# EAGLE schematic SensorStick (EAGLE 9.6.2)

## Sheet 1 of 2
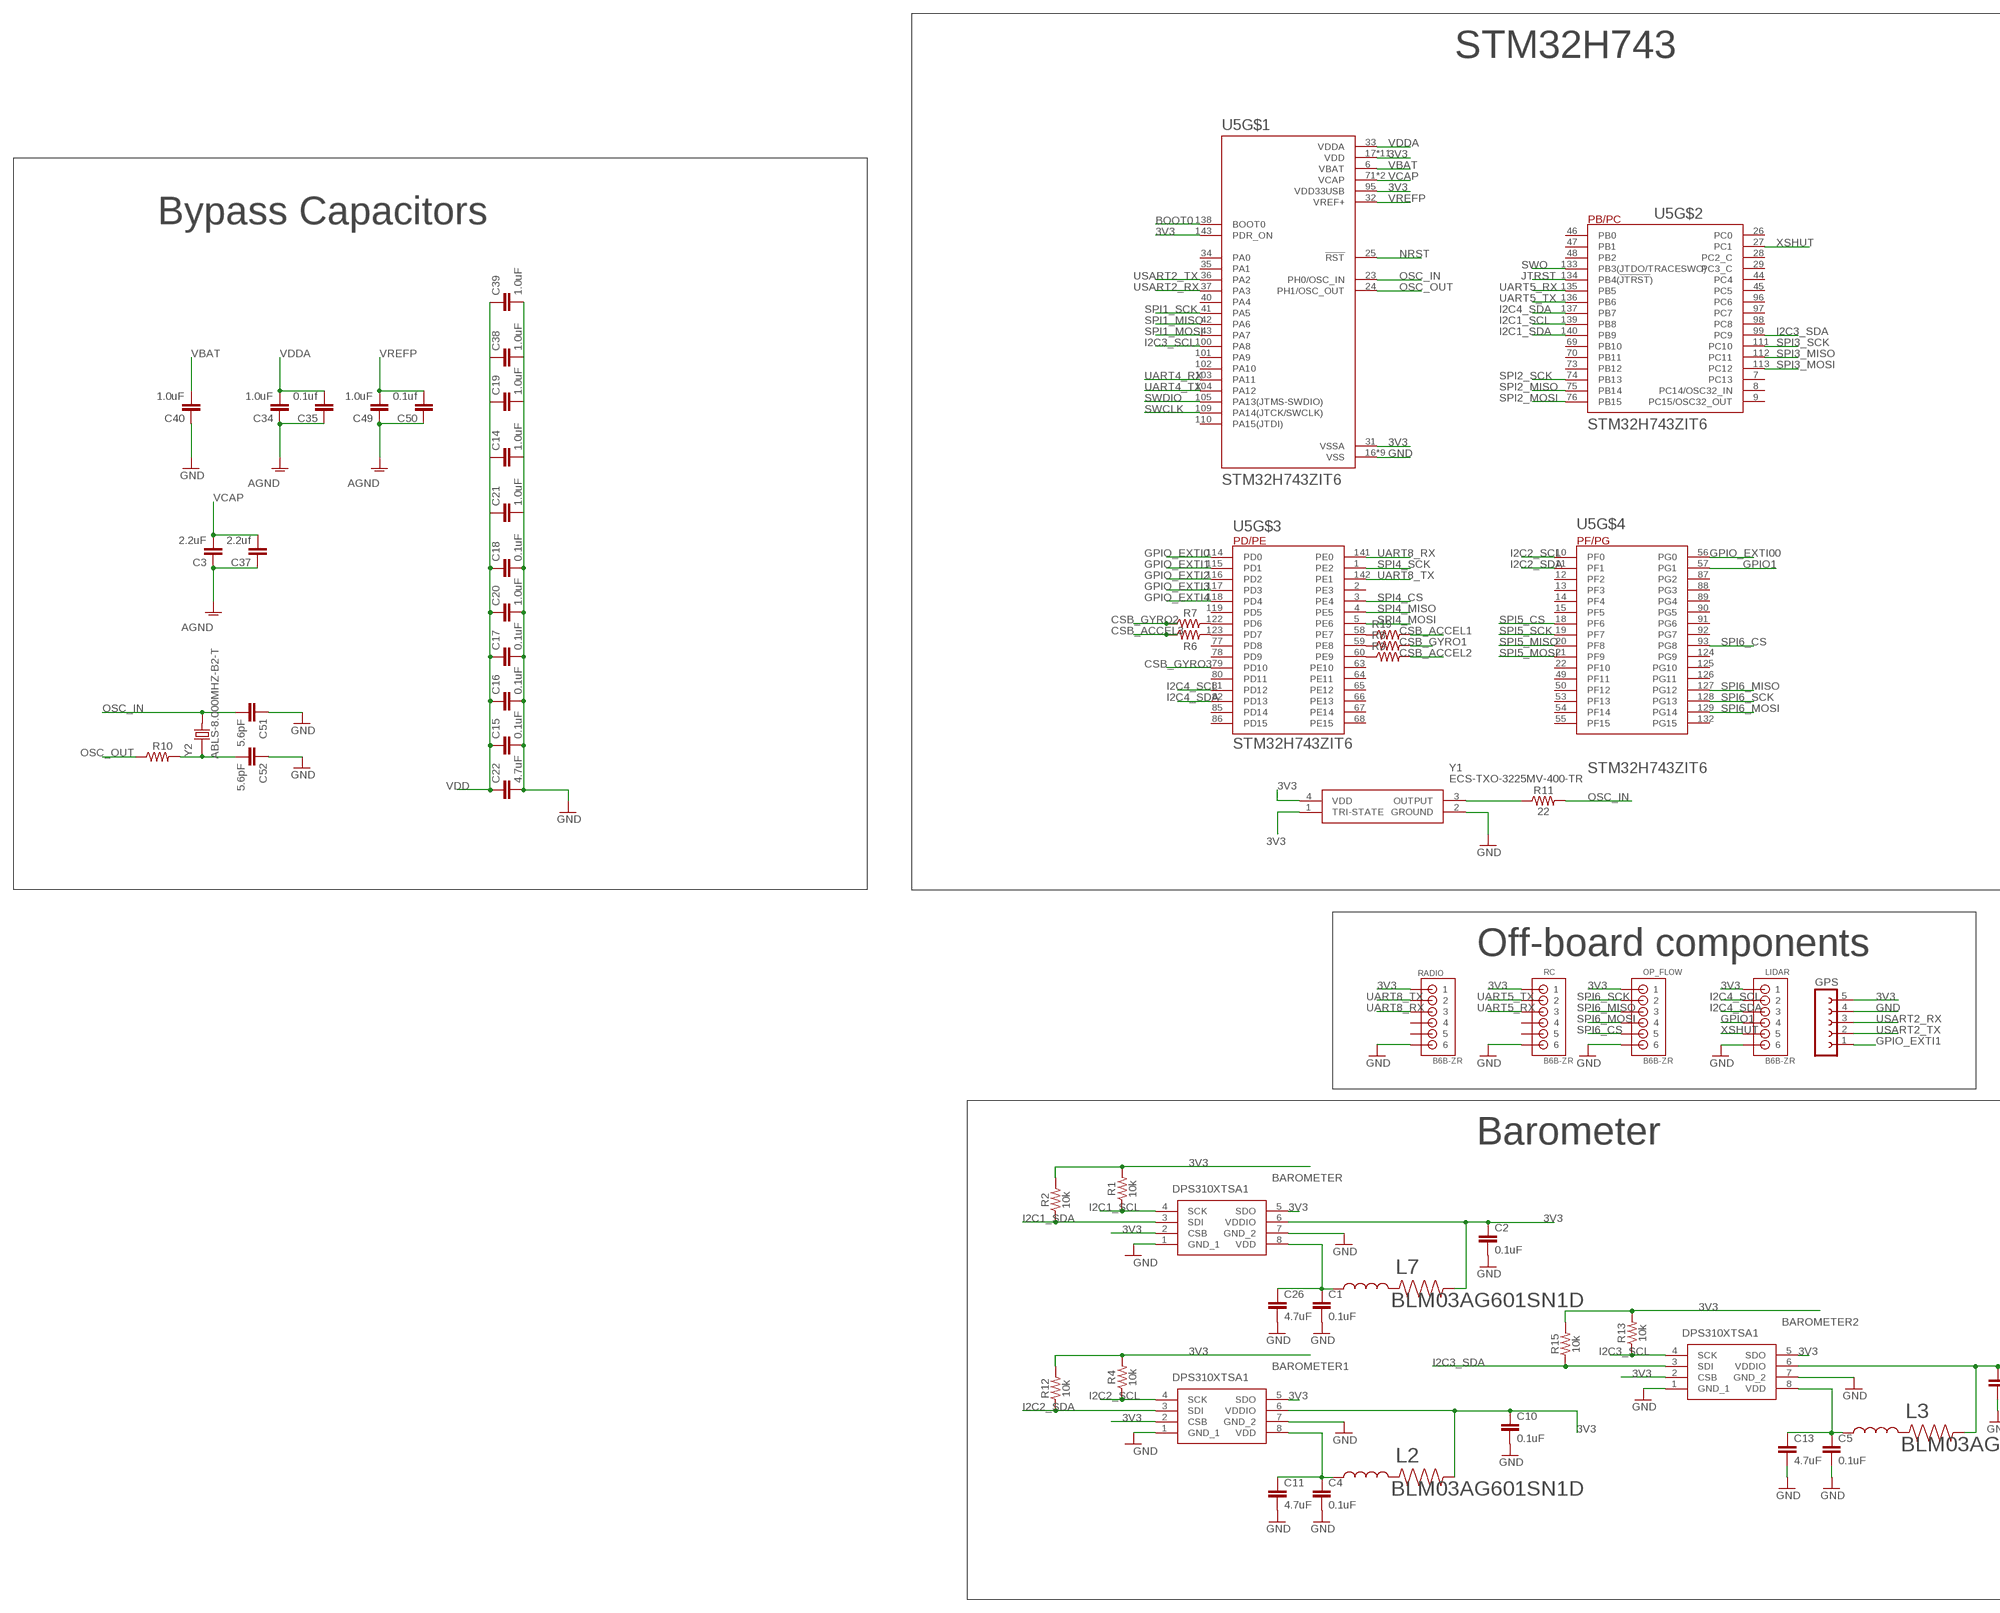
[diagram p0: schematic, sheet 1, part 1 of 2]
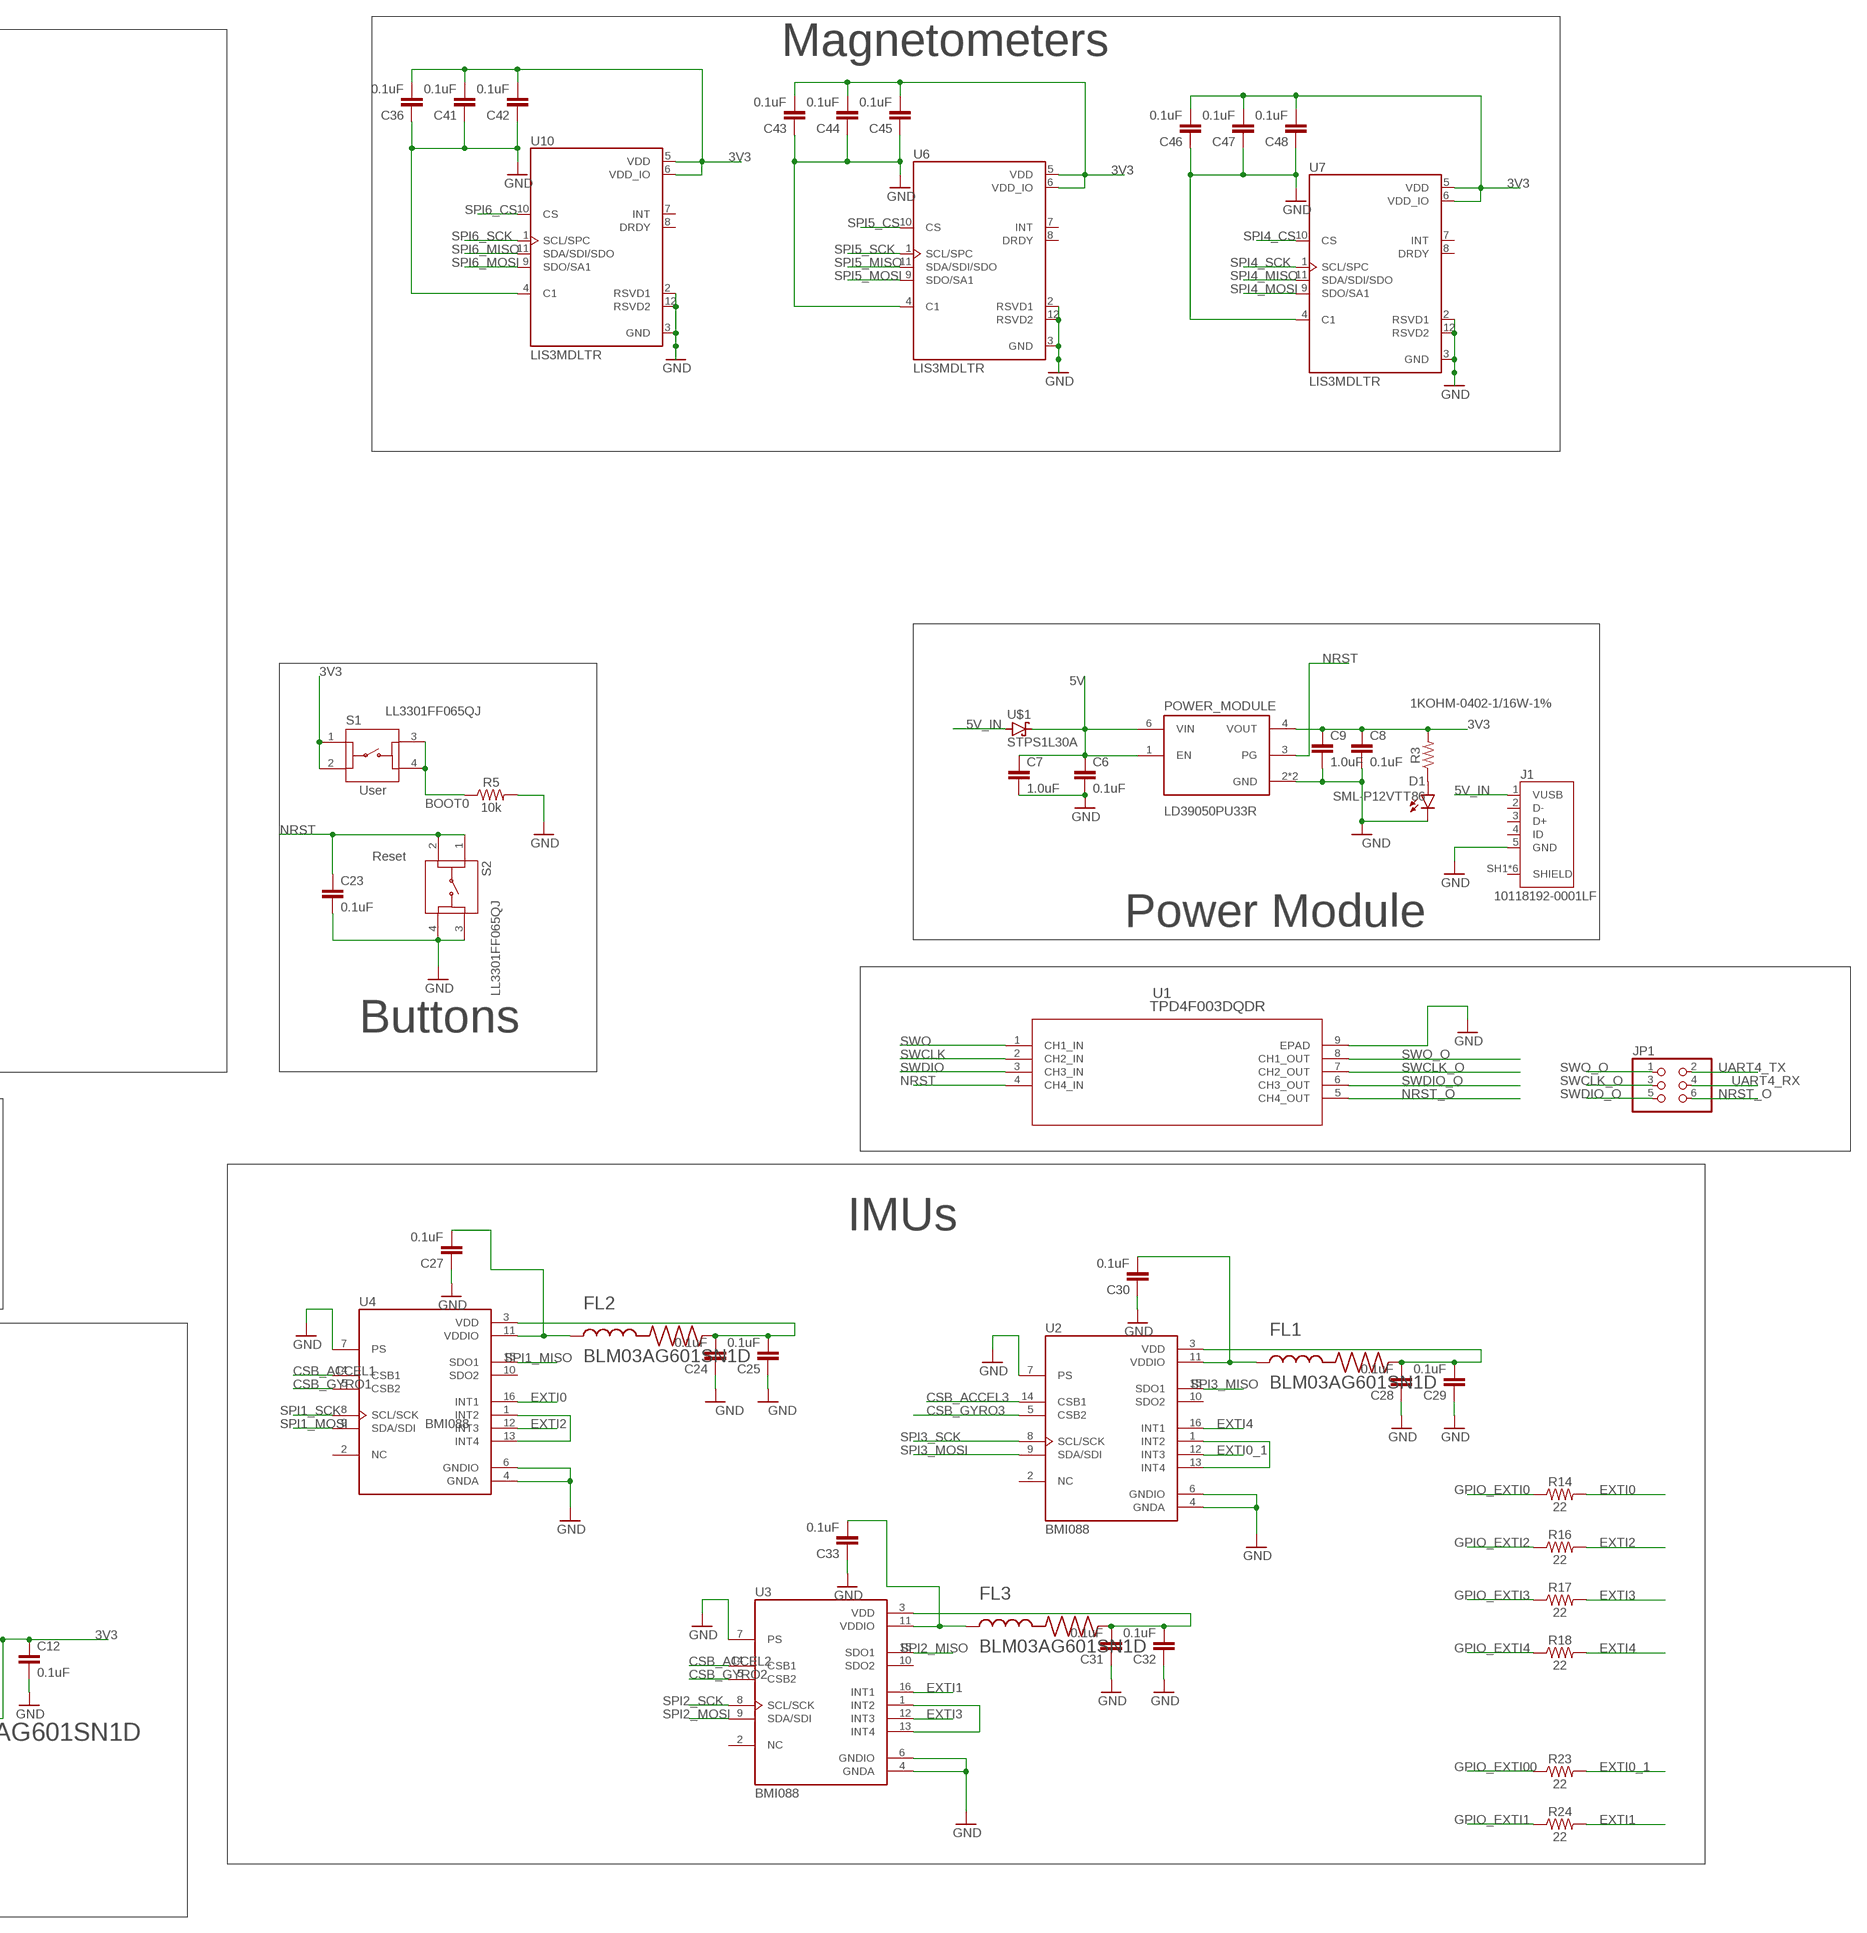
[diagram p1: schematic, sheet 1, part 2 of 2]

### Parts
BAROMETER  DPS310XTSA1  [DPS310XTSA1]
BAROMETER1  DPS310XTSA1  [DPS310XTSA1]
BAROMETER2  DPS310XTSA1  [DPS310XTSA1]
C1  0.1uF  0.1UF-0402-6.3V-10%-X7R  [0402]
C2  0.1uF  0.1UF-0402-6.3V-10%-X7R  [0402]
C3  2.2uF  1.0UF-0805-25V-10%  [0805]
C4  0.1uF  0.1UF-0402-6.3V-10%-X7R  [0402]
C5  0.1uF  0.1UF-0402-6.3V-10%-X7R  [0402]
C6  0.1uF  0.1UF-0402-6.3V-10%-X7R  [0402]
C7  1.0uF  1.0UF-0402-16V-10%  [0402]
C8  0.1uF  0.1UF-0402-6.3V-10%-X7R  [0402]
C9  1.0uF  1.0UF-0402-16V-10%  [0402]
C10  0.1uF  0.1UF-0402-6.3V-10%-X7R  [0402]
C11  4.7uF  4.7UF0603  [0603]
C12  0.1uF  0.1UF-0402-6.3V-10%-X7R  [0402]
C13  4.7uF  4.7UF0603  [0603]
C14  1.0uF  1.0UF-0805-25V-10%  [0805]
C15  0.1uF  0.1UF-0603-25V-5%  [0603]
C16  0.1uF  0.1UF-0603-25V-5%  [0603]
C17  0.1uF  0.1UF-0603-25V-5%  [0603]
C18  0.1uF  0.1UF-0603-25V-5%  [0603]
C19  1.0uF  1.0UF-0805-25V-10%  [0805]
C20  1.0uF  1.0UF-0805-25V-10%  [0805]
C21  1.0uF  1.0UF-0805-25V-10%  [0805]
C22  4.7uF  4.7UF0603  [0603]
C23  0.1uF  0.1UF-0603-25V-5%  [0603]
C24  0.1uF  0.1UF-0603-25V-5%  [0603]
C25  0.1uF  0.1UF-0603-25V-5%  [0603]
C26  4.7uF  4.7UF0603  [0603]
C27  0.1uF  0.1UF-0603-25V-5%  [0603]
C28  0.1uF  0.1UF-0603-25V-5%  [0603]
C29  0.1uF  0.1UF-0603-25V-5%  [0603]
C30  0.1uF  0.1UF-0603-25V-5%  [0603]
C31  0.1uF  0.1UF-0603-25V-5%  [0603]
C32  0.1uF  0.1UF-0603-25V-5%  [0603]
C33  0.1uF  0.1UF-0603-25V-5%  [0603]
C34  1.0uF  1.0UF-0805-25V-10%  [0805]
C35  0.1uf  1.0UF-0805-25V-10%  [0805]
C36  0.1uF  0.1UF-0603-25V-5%  [0603]
C37  2.2uf  1.0UF-0805-25V-10%  [0805]
C38  1.0uF  1.0UF-0805-25V-10%  [0805]
C39  1.0uF  1.0UF-0805-25V-10%  [0805]
C40  1.0uF  1.0UF-0805-25V-10%  [0805]
C41  0.1uF  0.1UF-0603-25V-5%  [0603]
C42  0.1uF  0.1UF-0603-25V-5%  [0603]
C43  0.1uF  0.1UF-0603-25V-5%  [0603]
C44  0.1uF  0.1UF-0603-25V-5%  [0603]
C45  0.1uF  0.1UF-0603-25V-5%  [0603]
C46  0.1uF  0.1UF-0603-25V-5%  [0603]
C47  0.1uF  0.1UF-0603-25V-5%  [0603]
C48  0.1uF  0.1UF-0603-25V-5%  [0603]
C49  1.0uF  1.0UF-0805-25V-10%  [0805]
C50  0.1uf  1.0UF-0805-25V-10%  [0805]
C51  5.6pF  1.0UF-0805-25V-10%  [0805]
C52  5.6pF  1.0UF-0805-25V-10%  [0805]
D1  SML-P12VTT86  [LED_SML-P11UTT86R]
FL1  BLM03AG601SN1D  [BEADC0603X33N]
FL2  BLM03AG601SN1D  [BEADC0603X33N]
FL3  BLM03AG601SN1D  [BEADC0603X33N]
GPS  FE05-1  [FE05-1]
J1  10118192-0001LF  [AMPHENOL_10118192-0001LF]
JP1  PINHD-2X3  [2X03]
L2  BLM03AG601SN1D  [BEADC0603X33N]
L3  BLM03AG601SN1D  [BEADC0603X33N]
L7  BLM03AG601SN1D  [BEADC0603X33N]
LIDAR  B6B-ZR  [B6B-ZR]
OP_FLOW  B6B-ZR  [B6B-ZR]
POWER_MODULE  LD39050PU33R  [SON95P300X300X100-7N]
R1  10k  10KOHM-0402-1/16W-1%  [0402]
R2  10k  10KOHM-0402-1/16W-1%  [0402]
R3  1KOHM-0402-1/16W-1%  [0402]
R4  10k  10KOHM-0402-1/16W-1%  [0402]
R5  10k  10KOHM-0603-1/10W-1%  [0603]
R6  RT0402FRE07220RL  [RESC1005X35N]
R7  RT0402FRE07220RL  [RESC1005X35N]
R8  RT0402FRE07220RL  [RESC1005X35N]
R9  RT0402FRE07220RL  [RESC1005X35N]
R10  220  RT0402FRE07220RL  [RESC1005X35N]
R11  22  22OHM-0402-1/10W-1%  [0402]
R12  10k  10KOHM-0402-1/16W-1%  [0402]
R13  10k  10KOHM-0402-1/16W-1%  [0402]
R14  22  22OHM-0402-1/10W-1%  [0402]
R15  10k  10KOHM-0402-1/16W-1%  [0402]
R16  22  22OHM-0402-1/10W-1%  [0402]
R17  22  22OHM-0402-1/10W-1%  [0402]
R18  22  22OHM-0402-1/10W-1%  [0402]
R19  RT0402FRE07220RL  [RESC1005X35N]
R23  22  22OHM-0402-1/10W-1%  [0402]
R24  22  22OHM-0402-1/10W-1%  [0402]
RADIO  B6B-ZR  [B6B-ZR]
RC  B6B-ZR  [B6B-ZR]
S1  LL3301FF065QJ  [LL3301FF065QJ]
S2  LL3301FF065QJ  [LL3301FF065QJ]
U1  TPD4F003DQDR  [DQD8_1P2X0P4]
U2  BMI088  [PQFN50P450X300X100-16N]
U3  BMI088  [PQFN50P450X300X100-16N]
U4  BMI088  [PQFN50P450X300X100-16N]
U5  STM32H743ZIT6  [QFP50P2200X2200X160-144N]
U6  LIS3MDLTR  [XDCR_LIS3MDLTR]
U7  LIS3MDLTR  [XDCR_LIS3MDLTR]
U10  LIS3MDLTR  [XDCR_LIS3MDLTR]
U$1  STPS1L30A  [DIOM5226X223N]
Y1  ECS-TXO-3225MV-400-TR  [ECSTXO3225MV400TR]
Y2  ABLS-8.000MHZ-B2-T  [XTAL_ABLS-8.000MHZ-B2-T]

### Nets
3V2: C28.2 C29.2 FL1.2 U2.3(VDD)
3V3: BAROMETER1.2(CSB) BAROMETER1.5(SDO) BAROMETER1.6(VDDIO) BAROMETER2.2(CSB) BAROMETER2.5(SDO) BAROMETER2.6(VDDIO) BAROMETER.2(CSB) BAROMETER.5(SDO) BAROMETER.6(VDDIO) C2.1 C8.1 C9.1 C10.1 C12.1 C36.2 C41.2 C42.2 C43.2 C44.2 C45.2 C46.2 C47.2 C48.2 GPS.5 L2.2 L3.2 L7.2 LIDAR.1 OP_FLOW.1 POWER_MODULE.4(VOUT) R1.2 R2.2 R3.2 R4.2 R12.2 R13.2 R15.2 RADIO.1 RC.1 S1.1 S1.2 U5.17(VDD) U5.30(VDD) U5.31(VSSA) U5.39(VDD) U5.52(VDD) U5.62(VDD) U5.72(VDD) U5.84(VDD) U5.95(VDD33USB) U5.108(VDD) U5.121(VDD) U5.131(VDD) U5.143(PDR_ON) U5.144(VDD) U6.5(VDD) U6.6(VDD_IO) U7.5(VDD) U7.6(VDD_IO) U10.5(VDD) U10.6(VDD_IO) Y1.1(TRI-STATE) Y1.4(VDD)
3V4: C24.2 C25.2 FL2.2 U4.3(VDD)
3V5: C31.2 C32.2 FL3.2 U3.3(VDD)
5V: C6.1 C7.1 POWER_MODULE.1(EN) POWER_MODULE.6(VIN) U$1.1(C)
5V_IN: J1.1(VUSB) U$1.2(A)
AGND: C3.1 C34.1 C35.1 C37.1 C49.1 C50.1
BOOT0: R5.1 S1.3 S1.4 U5.138(BOOT0)
CSB_ACCEL1: R19.2 U4.14(CSB1)
CSB_ACCEL2: R9.2 U3.14(CSB1)
CSB_ACCEL3: R6.1 U2.14(CSB1)
CSB_GYRO1: R8.2 U4.5(CSB2)
CSB_GYRO2: R7.1 U3.5(CSB2)
CSB_GYRO3: U2.5(CSB2) U5.79(PD10)
EXTI0: R14.2 U4.16(INT1)
EXTI0_1: R23.2 U2.12(INT3)
EXTI1: R24.2 U3.16(INT1)
EXTI2: R16.2 U4.12(INT3)
EXTI3: R17.2 U3.12(INT3)
EXTI4: R18.2 U2.16(INT1)
GND: BAROMETER1.1(GND_1) BAROMETER1.7(GND_2) BAROMETER2.1(GND_1) BAROMETER2.7(GND_2) BAROMETER.1(GND_1) BAROMETER.7(GND_2) C1.2 C2.2 C4.2 C5.2 C6.2 C7.2 C8.2 C9.2 C10.2 C11.2 C12.2 C13.2 C23.2 C24.1 C25.1 C26.2 C27.1 C28.1 C29.1 C30.1 C31.1 C32.1 C33.1 C36.1 C40.1 C41.1 C42.1 C43.1 C44.1 C45.1 C46.1 C47.1 C48.1 C51.1 C52.1 D1.C GPS.4 J1.5(GND) LIDAR.6 OP_FLOW.6 POWER_MODULE.2(GND) POWER_MODULE.7(GND) R5.2 S2.3 S2.4 U1.9(EPAD) U2.4(GNDA) U2.6(GNDIO) U2.7(PS) U3.4(GNDA) U3.6(GNDIO) U3.7(PS) U4.4(GNDA) U4.6(GNDIO) U4.7(PS) U5.16(VSS) U5.38(VSS) U5.51(VSS) U5.61(VSS) U5.83(VSS) U5.94(VSS) U5.107(VSS) U5.120(VSS) U5.130(VSS) U6.2(RSVD1) U6.3(GND) U6.4(C1) U6.12(RSVD2) U7.2(RSVD1) U7.3(GND) U7.4(C1) U7.12(RSVD2) U10.2(RSVD1) U10.3(GND) U10.4(C1) U10.12(RSVD2) Y1.2(GROUND)
GND1: C14.2 C15.2 C16.2 C17.2 C18.2 C20.2 C21.2 C22.2 ; supply symbol labelled GND
GND2: C19.2
GND3: C38.2
GND4: C39.2
GPIO1: LIDAR.4 U5.57(PG1)
GPIO_EXTI0: R14.1 U5.114(PD0)
GPIO_EXTI00: R23.1 U5.56(PG0)
GPIO_EXTI1: GPS.1 R24.1 U5.115(PD1)
GPIO_EXTI2: R16.1 U5.116(PD2)
GPIO_EXTI3: R17.1 U5.117(PD3)
GPIO_EXTI4: R18.1 U5.118(PD4)
I2C1_SCL: BAROMETER.4(SCK) R1.1 U5.139(PB8)
I2C1_SDA: BAROMETER.3(SDI) R2.1 U5.140(PB9)
I2C2_SCL: BAROMETER1.4(SCK) R4.1 U5.10(PF0)
I2C2_SDA: BAROMETER1.3(SDI) R12.1 U5.11(PF1)
I2C3_SCL: BAROMETER2.4(SCK) R13.1 U5.100(PA8)
I2C3_SDA: BAROMETER2.3(SDI) R15.1 U5.99(PC9)
I2C4_SCL: LIDAR.2 U5.81(PD12)
I2C4_SDA: LIDAR.3 U5.82(PD13) U5.137(PB7)
IMU_INT3: U3.1(INT2) U3.13(INT4)
JTRST: U5.134(PB4(!JTRST!))
N$1: R11.1 Y1.3(OUTPUT)
N$2: BAROMETER2.8(VDD) C5.1 C13.1 L3.1
N$3: BAROMETER1.8(VDD) C4.1 C11.1 L2.1
N$5: D1.A R3.1
N$6: BAROMETER.8(VDD) C1.1 C26.1 L7.1
N$7: C52.2 R10.2 Y2.1
N$8: C27.2 FL2.1 U4.11(VDDIO)
N$9: C30.2 FL1.1 U2.11(VDDIO)
N$10: C33.2 FL3.1 U3.11(VDDIO)
N$13: R6.2 U5.123(PD7)
N$14: R7.2 U5.122(PD6)
N$15: R19.1 U5.58(PE7)
N$16: R8.1 U5.59(PE8)
N$17: R9.1 U5.60(PE9)
N$19: RADIO.6 RC.6 ; supply symbol labelled GND
N$20: U4.1(INT2) U4.13(INT4)
N$23: U2.1(INT2) U2.13(INT4)
NRST: C23.1 POWER_MODULE.3(PG) S2.1 S2.2 U1.4(CH4_IN) U5.25(!RST)
NRST_O: JP1.6 U1.5(CH4_OUT)
OSC_IN: C51.2 R11.2 U5.23(PH0/OSC_IN) Y2.2
OSC_OUT: R10.1 U5.24(PH1/OSC_OUT)
SPI1_MISO: U4.15(SDO1) U5.42(PA6)
SPI1_MOSI: U4.9(SDA/SDI) U5.43(PA7)
SPI1_SCK: U4.8(SCL/SCK) U5.41(PA5)
SPI2_MISO: U3.15(SDO1) U5.75(PB14)
SPI2_MOSI: U3.9(SDA/SDI) U5.76(PB15)
SPI2_SCK: U3.8(SCL/SCK) U5.74(PB13)
SPI3_MISO: U2.15(SDO1) U5.112(PC11)
SPI3_MOSI: U2.9(SDA/SDI) U5.113(PC12)
SPI3_SCK: U2.8(SCL/SCK) U5.111(PC10)
SPI4_CS: U5.3(PE4) U7.10(CS)
SPI4_MISO: U5.4(PE5) U7.11(SDA/SDI/SDO)
SPI4_MOSI: U5.5(PE6) U7.9(SDO/SA1)
SPI4_SCK: U5.1(PE2) U7.1(SCL/SPC)
SPI5_CS: U5.18(PF6) U6.10(CS)
SPI5_MISO: U5.20(PF8) U6.11(SDA/SDI/SDO)
SPI5_MOSI: U5.21(PF9) U6.9(SDO/SA1)
SPI5_SCK: U5.19(PF7) U6.1(SCL/SPC)
SPI6_CS: OP_FLOW.5 U5.93(PG8) U10.10(CS)
SPI6_MISO: OP_FLOW.3 U5.127(PG12) U10.11(SDA/SDI/SDO)
SPI6_MOSI: OP_FLOW.4 U5.129(PG14) U10.9(SDO/SA1)
SPI6_SCK: OP_FLOW.2 U5.128(PG13) U10.1(SCL/SPC)
SWCLK: U1.2(CH2_IN) U5.109(PA14(JTCK/SWCLK))
SWCLK_O: JP1.3 U1.7(CH2_OUT)
SWDIO: U1.3(CH3_IN) U5.105(PA13(JTMS-SWDIO))
SWDIO_O: JP1.5 U1.6(CH3_OUT)
SWO: U1.1(CH1_IN) U5.133(PB3(JTDO/TRACESWO))
SWO_O: JP1.1 U1.8(CH1_OUT)
UART4_RX: JP1.4 U5.103(PA11)
UART4_TX: JP1.2 U5.104(PA12)
UART5_RX: RC.3 U5.135(PB5)
UART5_TX: RC.2 U5.136(PB6)
UART8_RX: RADIO.3 U5.141(PE0)
UART8_TX: RADIO.2 U5.142(PE1)
USART2_RX: GPS.3 U5.37(PA3)
USART2_TX: GPS.2 U5.36(PA2)
VBAT: C40.2 U5.6(VBAT)
VCAP: C3.2 C37.2 U5.71(VCAP) U5.106(VCAP)
VDD: C15.1 C16.1 C17.1 C18.1 C20.1 C21.1 C22.1
VDDA: C34.2 C35.2 U5.33(VDDA)
VREF1: C14.1
VREF2: C19.1
VREF3: C38.1
VREF4: C39.1
VREFP: C49.2 C50.2 U5.32(VREF+)
XSHUT: LIDAR.5 U5.27(PC1)
Unconnected: J1.2(D-) J1.3(D+) J1.4(ID) J1.SH1(SHIELD) J1.SH2(SHIELD) J1.SH3(SHIELD) J1.SH4(SHIELD) J1.SH5(SHIELD) J1.SH6(SHIELD) RADIO.4 RADIO.5 RC.4 RC.5 U2.2(NC) U2.10(SDO2) U3.2(NC) U3.10(SDO2) U4.2(NC) U4.10(SDO2) U5.2(PE3) U5.7(PC13) U5.8(PC14/OSC32_IN) U5.9(PC15/OSC32_OUT) U5.12(PF2) U5.13(PF3) U5.14(PF4) U5.15(PF5) U5.22(PF10) U5.26(PC0) U5.28(PC2_C) U5.29(PC3_C) U5.34(PA0) U5.35(PA1) U5.40(PA4) U5.44(PC4) U5.45(PC5) U5.46(PB0) U5.47(PB1) U5.48(PB2) U5.49(PF11) U5.50(PF12) U5.53(PF13) U5.54(PF14) U5.55(PF15) U5.63(PE10) U5.64(PE11) U5.65(PE12) U5.66(PE13) U5.67(PE14) U5.68(PE15) U5.69(PB10) U5.70(PB11) U5.73(PB12) U5.77(PD8) U5.78(PD9) U5.80(PD11) U5.85(PD14) U5.86(PD15) U5.87(PG2) U5.88(PG3) U5.89(PG4) U5.90(PG5) U5.91(PG6) U5.92(PG7) U5.96(PC6) U5.97(PC7) U5.98(PC8) U5.101(PA9) U5.102(PA10) U5.110(PA15(JTDI)) U5.119(PD5) U5.124(PG9) U5.125(PG10) U5.126(PG11) U5.132(PG15) U6.7(INT) U6.8(DRDY) U7.7(INT) U7.8(DRDY) U10.7(INT) U10.8(DRDY)

### Notes on the sheet
- Magnetometers
- STM32H743
- Bypass Capacitors
- User
- Reset
- Power Module
- Buttons
- Off-board components
- IMUs
- Barometer

## Sheet 2 of 2

## Library data of the parts
BAROMETER BAROMETER1 BAROMETER2 = DPS310XTSA1:DPS310XTSA1: INFINEON - DPS310XTSA1 - DIGITAL PRESSURE SENSOR, 1200HPA, VLGA-8 Source: Datasheet <https://www.infineon.com/dgdl/Infineon-DPS310-DS-v01_00-EN.pdf?fileId=5546d462576f34750157750826c42242>; ARROW_PART_NUMBER: DPS310XTSA1; ARROW_PRICE-STOCK: https://www.arrow.com/en/products/dps310xtsa1/infineon-technologies-ag?region=nac; DESCRIPTION: INFINEON - DPS310XTSA1 - DIGITAL PRESSURE SENSOR, 1200HPA, VLGA-8; HEIGHT: 1.01mm; MANUFACTURER_NAME: Infineon; MANUFACTURER_PART_NUMBER: DPS310XTSA1; MOUSER_PART_NUMBER: 726-DPS310XTSA1; MOUSER_PRICE-STOCK: https://www.mouser.co.uk/ProductDetail/Infineon-Technologies/DPS310XTSA1?qs=uuTTuBTXn66Ynca8WHwycg%3D%3D
C1 C2 C4-C6 C8 C10 C12 = SparkFun-Capacitors:0.1UF: 0.1µF ceramic capacitors A capacitor is a passive two-terminal electrical component used to store electrical energy temporarily in an electric field.; PROD_ID: CAP-14993
C3 C35 C37 C50-C52 = SparkFun-Capacitors:1.0UF: 1µF ceramic capacitors A capacitor is a passive two-terminal electrical component used to store electrical energy temporarily in an electric field.; PROD_ID: CAP-08064; VALUE: 1.0uF
C7 C9 = SparkFun-Capacitors:1.0UF: 1µF ceramic capacitors A capacitor is a passive two-terminal electrical component used to store electrical energy temporarily in an electric field.; PROD_ID: CAP-12417
C11 C13 C22 C26 = SparkFun-Capacitors:4.7UF: 4.7µF ceramic capacitors A capacitor is a passive two-terminal electrical component used to store electrical energy temporarily in an electric field.; PROD_ID: CAP-08280
C14 C19-C21 C34 C38-C40 C49 = SparkFun-Capacitors:1.0UF: 1µF ceramic capacitors A capacitor is a passive two-terminal electrical component used to store electrical energy temporarily in an electric field.; PROD_ID: CAP-08064
C15-C18 C23-C25 C27-C33 C36 C41-C48 = SparkFun-Capacitors:0.1UF: 0.1µF ceramic capacitors A capacitor is a passive two-terminal electrical component used to store electrical energy temporarily in an electric field.; PROD_ID: CAP-08604
D1 = ce-capstone:SML-P12VTT86: SML-P1 Series Red 0402 Clear 60 mcd 2 V Surface Mount PICOLED LED; AVAILABILITY: Unavailable; DESCRIPTION: Red 630nm LED Indication - Discrete 2V 0402 _1006 Metric_; MF: Rohm; MP: SML-P12VTT86; PACKAGE: 0402 Rohm; PRICE: None
FL1-FL3 L2 L3 L7 = BLM03AG601SN1D:BLM03AG601SN1D: Ferrite Bead 600R 100mA SMD 0201 Check availability <https://pricing.snapeda.com/parts/BLM03AG601SN1D/Murata%20Electronics/view-part?ref=eda>; AVAILABILITY: In Stock; CHECK_PRICES: https://www.snapeda.com/parts/BLM03AG601SN1D/Murata/view-part/?ref=eda; DESCRIPTION: 600 Ohms @ 100 MHz 1 - Ferrite Bead 0201 (0603 Metric) 100mA 1.5Ohm; MF: Murata Electronics; MP: BLM03AG601SN1D; PACKAGE: 0603 Murata; PRICE: None; PURCHASE-URL: https://www.snapeda.com/api/url_track_click_mouser/?unipart_id=283112&manufacturer=Murata Electronics&part_name=BLM03AG601SN1D&search_term=None; SNAPEDA_LINK: https://www.snapeda.com/parts/BLM03AG601SN1D/Murata/view-part/?ref=snap
GPS = con-lsta:FE05-1: FEMALE HEADER; OC_FARNELL: unknown; OC_NEWARK: unknown
J1 = ce-capstone:10118192-0001LF: Single Port 5 Contact Horizontal Right Angle Shielded Micro B USB 2.0 Connector; AVAILABILITY: Unavailable; DESCRIPTION: USB - micro B USB 2.0 Receptacle Connector 5 Position Surface Mount, Right Angle; MF: Amphenol ICC; MP: 10118192-0001LF; PACKAGE: None; PRICE: None
JP1 = pinhead:PINHD-2X3: PIN HEADER
LIDAR OP_FLOW RADIO RC = jst:B6B-ZR: JST-ZH Connector 6 pol, 1.5mm pitch Package: B6B-ZR Source: http://www.jst-mfg.com/product/pdf/eng/eZH.pdf
POWER_MODULE = ce-capstone:LD39050PU33R: LD39050 Series 500 mA 3.3 V Fixed Low Noise LDO Voltage Regulator - DFN-6; AVAILABILITY: Unavailable; DESCRIPTION: Linear Voltage Regulator IC 1 Output 500mA 6-DFN _3x3_; MF: STMicroelectronics; MP: LD39050PU33R; PACKAGE: DFN-6 STMicroelectronics; PRICE: None
R1 R2 R4 R12 R13 R15 = SparkFun-Resistors:10KOHM: 10kΩ resistor A resistor is a passive two-terminal electrical component that implements electrical resistance as a circuit element. Resistors act to reduce current flow, and, at the same time, act to lower voltage levels within circuits. - Wikipedia; PROD_ID: RES-14241
R3 = SparkFun-Resistors:1KOHM: 1kΩ resistor A resistor is a passive two-terminal electrical component that implements electrical resistance as a circuit element. Resistors act to reduce current flow, and, at the same time, act to lower voltage levels within circuits. - Wikipedia; PROD_ID: RES-14342
R5 = SparkFun-Resistors:10KOHM: 10kΩ resistor A resistor is a passive two-terminal electrical component that implements electrical resistance as a circuit element. Resistors act to reduce current flow, and, at the same time, act to lower voltage levels within circuits. - Wikipedia; PROD_ID: RES-00824
R6-R10 R19 = ce-capstone:RT0402FRE07220RL: RES SMD 4.7K OHM 1% 1/16W 0402; DESCRIPTION: 4.7 kOhms ±1% 0.063W, 1/16W Chip Resistor 0402 _1005 Metric_ Thin Film; DIGI-KEY_PART_NUMBER: YAG3347CT-ND; DIGI-KEY_PURCHASE_URL: https://www.digikey.com/product-detail/en/yageo/RT0402FRE074K7L/YAG3347CT-ND/5418052?utm_source=snapeda&utm_medium=aggregator&utm_campaign=symbol; MF: Yageo; MP: RT0402FRE074K7L; PACKAGE: 1005 Yageo
R11 R14 R16-R18 R23 R24 = SparkFun-Resistors:22OHM: 22Ω resistor A resistor is a passive two-terminal electrical component that implements electrical resistance as a circuit element. Resistors act to reduce current flow, and, at the same time, act to lower voltage levels within circuits. - Wikipedia; PROD_ID: RES-12427
S1 S2 = ce-capstone:LL3301FF065QJ: Pushbutton Switches 50mA 12VDC F065 7.0mm J-Lead Source: Datasheet <https://componentsearchengine.com/Datasheets/1/LL3301FF065QJ.pdf>; DESCRIPTION: Pushbutton Switches 50mA 12VDC F065 7.0mm J-Lead; HEIGHT: 7.3mm; MANUFACTURER_NAME: E-Switch; MANUFACTURER_PART_NUMBER: LL3301FF065QJ; MOUSER_PART_NUMBER: 612-LL3301FF065QJ; MOUSER_PRICE-STOCK: https://www.mouser.com/Search/Refine.aspx?Keyword=612-LL3301FF065QJ
U1 = TPD4F003DQDR:TPD4F003DQDR; COPYRIGHT: Copyright (C) 2023 Ultra Librarian. All rights reserved.; DIGI-KEY_PART_NUMBER_1: 296-25817-1-ND; DIGI-KEY_PART_NUMBER_2: 296-25817-2-ND; DIGI-KEY_PART_NUMBER_3: 296-25817-6-ND; DIGI-KEY_PART_NUMBER_4: 2156-TPD4F003DQDR-ND; MANUFACTURER_PART_NUMBER: TPD4F003DQDR; MFR_NAME: Texas Instruments
U2-U4 = BMI088:BMI088: High-performance 6-axis inertial sensor (accelerometer + gyroscope) Check prices <https://pricing.snapeda.com/parts/BMI088/Bosch%20Sensortec/view-part?ref=eda> Check availability <https://pricing.snapeda.com/parts/BMI088/Bosch%20Sensortec/view-part?ref=eda>; AVAILABILITY: In Stock; CHECK_PRICES: https://www.snapeda.com/parts/BMI088/Bosch+Sensortec/view-part/?ref=eda; DESCRIPTION: Accelerometer, Gyroscope, 6 Axis Sensor I2C, SPI Output; MF: Bosch Sensortec; MP: BMI088; PACKAGE: VFLGA-16 Bosch Sensortec; PRICE: None; PURCHASE-URL: https://www.snapeda.com/api/url_track_click_mouser/?unipart_id=2774026&manufacturer=Bosch Sensortec&part_name=BMI088&search_term=None; SNAPEDA_LINK: https://www.snapeda.com/parts/BMI088/Bosch+Sensortec/view-part/?ref=snap
U5 = STM32H743ZIT6:STM32H743ZIT6: High-performance and DSP with DP-FPU, ARM Cortex-M7 MCU with 2MBytes Flash, 1MB RAM, 400 MHz CPU, Art Accelerator, L1... Check availability <https://pricing.snapeda.com/parts/STM32H743ZIT6/STMicroelectronics/view-part?ref=eda>; AVAILABILITY: In Stock; CHECK_PRICES: https://www.snapeda.com/parts/STM32H743ZIT6/STMicroelectronics/view-part/?ref=eda; DESCRIPTION: ARM® Cortex®-M7 STM32H7 Microcontroller IC 32-Bit Single-Core 480MHz 2MB (2M x 8) FLASH 144-LQFP (20x20); MF: STMicroelectronics; MP: STM32H743ZIT6; PACKAGE: LQFP-144 STMicroelectronics; PRICE: None; PURCHASE-URL: https://www.snapeda.com/api/url_track_click_mouser/?unipart_id=1041111&manufacturer=STMicroelectronics&part_name=STM32H743ZIT6&search_term=stm32h743; SNAPEDA_LINK: https://www.snapeda.com/parts/STM32H743ZIT6/STMicroelectronics/view-part/?ref=snap; SPICEPREFIX: X
U6 U7 U10 = LIS3MDLTR:LIS3MDLTR: LIS3MDL Series 3 Axis ±2/±8/±12/±16 g 3.6V High Performance Magnetometer LGA-12 Check availability <https://pricing.snapeda.com/parts/LIS3MDLTR/STMicroelectronics/view-part?ref=eda>; AVAILABILITY: In Stock; CHECK_PRICES: https://www.snapeda.com/parts/LIS3MDLTR/STMicroelectronics/view-part/?ref=eda; DESCRIPTION: Magnetoresistive Sensor X, Y, Z Axis 12-LGA (2x2); MF: STMicroelectronics; MP: LIS3MDLTR; PACKAGE: VFLGA-12 STMicroelectronics; PRICE: None; PURCHASE-URL: https://www.snapeda.com/api/url_track_click_mouser/?unipart_id=382740&manufacturer=STMicroelectronics&part_name=LIS3MDLTR&search_term=None; SNAPEDA_LINK: https://www.snapeda.com/parts/LIS3MDLTR/STMicroelectronics/view-part/?ref=snap
U$1 = ce-capstone:STPS1L30A
Y1 = SamacSys_Parts:ECS-TXO-3225MV-400-TR: TCXO Oscillators 40.000 MHZ Multi-Volt +1.7 3.6V HCMOS TCXO +/-2.5 ppm -30 +85 C 3.2x 2.5mm RoHS Source: Datasheet <https://ecsxtal.com/store/pdf/ECS-TXO-3225MV.pdf>; DESCRIPTION: TCXO Oscillators 40.000 MHZ Multi-Volt +1.7 3.6V HCMOS TCXO +/-2.5 ppm -30 +85 C 3.2x 2.5mm RoHS; HEIGHT: 1.2mm; MANUFACTURER_NAME: ECS; MANUFACTURER_PART_NUMBER: ECS-TXO-3225MV-400-TR
Y2 = ce-capstone:ABLS-8.000MHZ-B2-T: Crystal 8MHz Â±20ppm (Tol) Â±50ppm (Stability) 18pF FUND 80Ohm 2-Pin HC-49/US SMD T/R; AVAILABILITY: Unavailable; DESCRIPTION: 8MHz ±20ppm Crystal 18pF 80 Ohms HC-49/US; MF: Abracon LLC; MP: ABLS-8.000MHZ-B2; PACKAGE: HC-49/US Abracon LLC; PRICE: None